# Altium schematic sheet Esp32_Wroom(Contrôle de RFID).SchDoc
size Tabloid; SheetNumber: 6; SheetTotal: 7
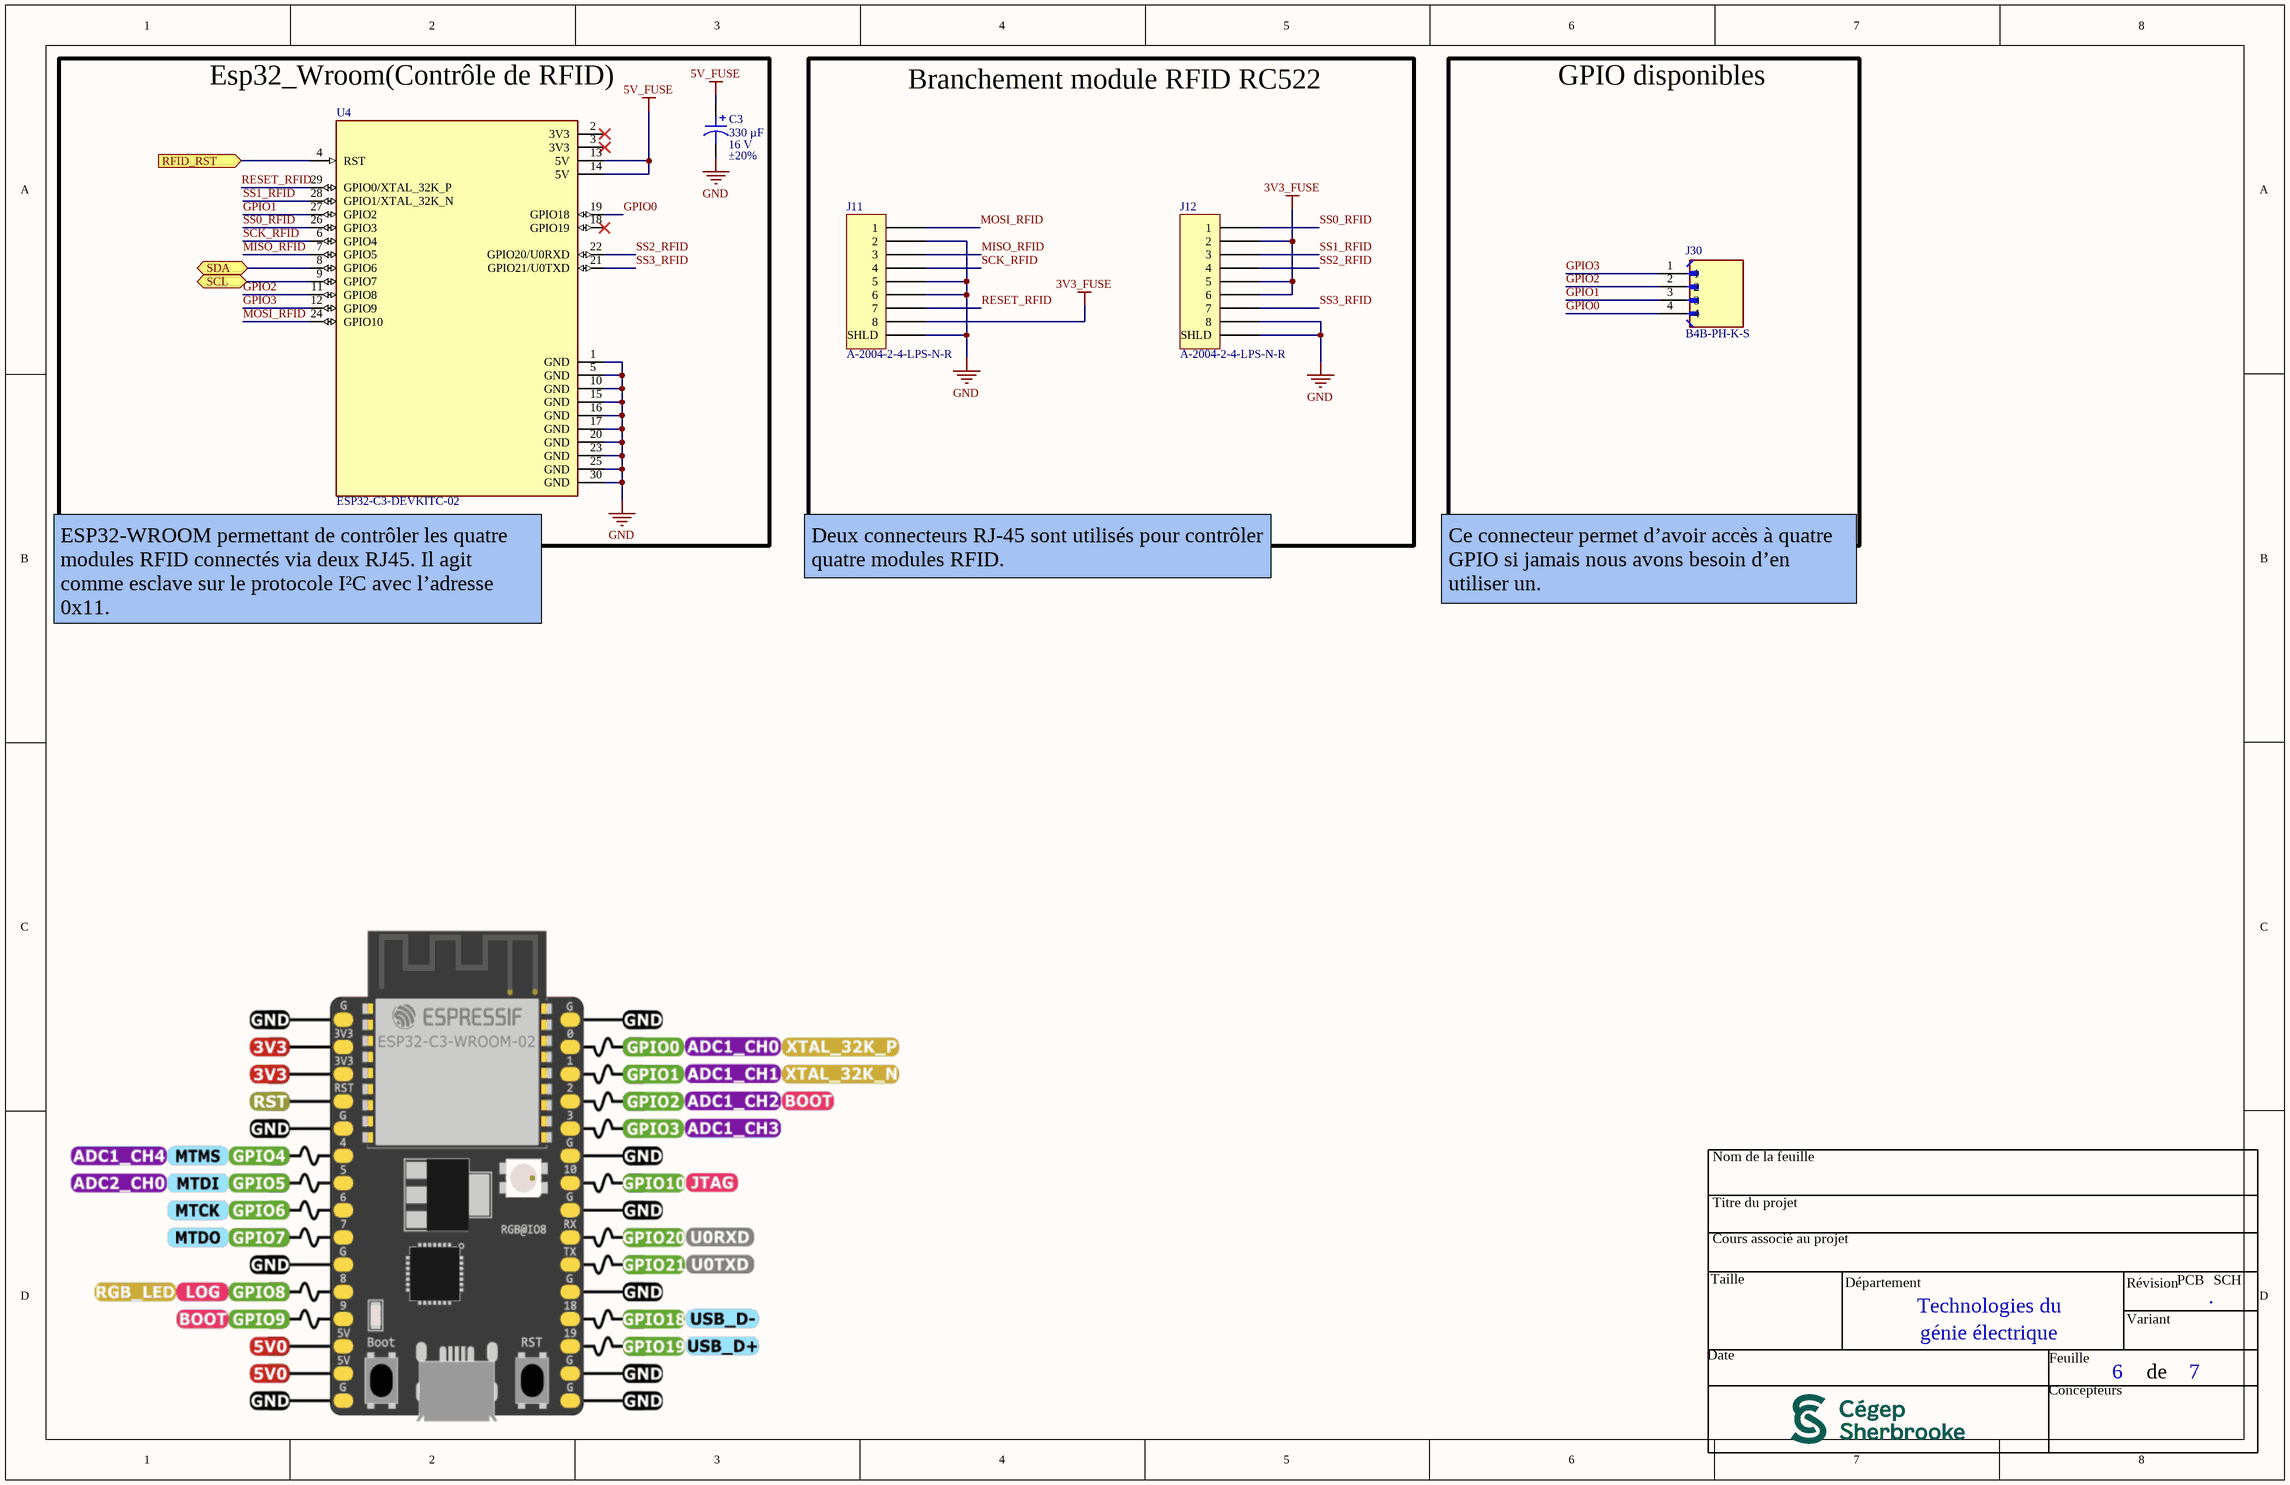
[diagram p0: Esp32_Wroom(Contrôle de RFID).SchDoc]

## Parts
C3  330 µF  Tolerance: ±20%  Voltage - Rated: 16 V  [CAP ALSMD 8.3MM H10.5MM]
J11  A-2004-2-4-LPS-N-R  [ASSMANN A-2004-2-4-LPS-N-R]
J12  A-2004-2-4-LPS-N-R  [ASSMANN A-2004-2-4-LPS-N-R]
J30  B4B-PH-K-S  [JST_B4B-PH-K-S]
U4  ESP32-C3-DEVKITC-02  [XCVR_ESP32-C3-DEVKITC-02]

## Blocks framed on the sheet
Esp32_Wroom(Contrôle de RFID): C3 U4
Branchement module RFID RC522: J11 J12
GPIO disponibles: J30

## Ports
RFID_RST (in), SCL (bidir), SDA (bidir)

## Nets
3V3_FUSE: J11.8 J12.2 J12.5 J12.6
5V_FUSE: C3.1 U4.13(5V) U4.14(5V)
GND: C3.2 J11.2 J11.5 J11.6 J11.S(SHLD) J12.8 J12.S(SHLD) U4.1(GND) U4.5(GND) U4.10(GND) U4.15(GND) U4.16(GND) U4.17(GND) U4.20(GND) U4.23(GND) U4.25(GND) U4.30(GND)
GPIO0: J30.4 U4.19(GPIO18)
GPIO1: J30.3 U4.27(GPIO2)
GPIO2: J30.2 U4.11(GPIO8)
GPIO3: J30.1 U4.12(GPIO9)
MISO_RFID: J11.3 U4.7(GPIO5)
MOSI_RFID: J11.1 U4.24(GPIO10)
RESET_RFID: J11.7 U4.29(GPIO0/XTAL_32K_P)
RFID_RST: U4.4(RST) ; port RFID_RST
SCK_RFID: J11.4 U4.6(GPIO4)
SCL: U4.9(GPIO7) ; port SCL
SDA: U4.8(GPIO6) ; port SDA
SS0_RFID: J12.1 U4.26(GPIO3)
SS1_RFID: J12.3 U4.28(GPIO1/XTAL_32K_N)
SS2_RFID: J12.4 U4.22(GPIO20/U0RXD)
SS3_RFID: J12.7 U4.21(GPIO21/U0TXD)

Not connected (* = marked no-connect by the designer): U4 2(3V3)* 3(3V3)* 18(GPIO19)*

## Notes on the sheet
- (near U4) ESP32-WROOM permettant de contrôler les quatre modules RFID connectés via deux RJ45. Il agit comme esclave sur le protocole I²C avec l’adresse 0x11.
- Deux connecteurs RJ-45 sont utilisés pour contrôler quatre modules RFID.
- Ce connecteur permet d’avoir accès à quatre GPIO si jamais nous avons besoin d’en utiliser un.
- Nom de la feuille
- Titre du projet
- Cours associé au projet
- Taille
- Département
- Technologies du
- Révision
- PCB
- .
- SCH
- Date
- génie électrique
- Feuille
- Variant
- de
- Concepteurs

## Library data of the parts
C3 = 865060353008: CAP ALUM 330UF 20% 16V SMD; manufacturer: Würth Elektronik; Impedance: 170 mOhms; Lifetime @ Temp.: 5000 Hrs @ 105°C; Polarization: Polar; Ripple Current @ High Frequency: 550 mA @ 100 kHz; Ripple Current @ Low Frequency: 357.5 mA @ 120 Hz; Surface Mount Land Size: 0.327" L x 0.327" W (8.30mm x 8.30mm); Part Number: 865060353008; Applications: General Purpose; Capacitance: 330 µF; componentlink1description: Datasheet; componentlink1url: https://katalog.we-online.de/pbs/datasheet/865060353008.pdf; componentlink2description: DigiKey Link; componentlink2url: https://www.digikey.com/en/products/detail/würth-elektronik/865060353008/5728120; Device Package: Radial, Can - SMD; Height - Seated (Max): 0.413" (10.50mm); lastupdated: 2024-06-03 8:15:49 PM; Lifecycle Status: Active; Minimum Order: 1; Mounting Type: Surface Mount; Operating Temperature: -55°C ~ 105°C; Package / Case: Radial, Can - SMD; packaging: TapeAndReel; partid: 7463; Part Status: Active; price: 0.39; series: WCAP-ASLL; Size / Dimension: 0.315" Dia (8.00mm); Supplier 1: DigiKey; Supplier Part Number 1: 732-8525-1-ND; value: 330 µF
J11 J12 = A-2004-2-4-LPS-N-R: CONN MOD JACK 8P8C R/A SHIELDED; Manufacturer: Assmann WSW Components; LED Color: Does Not Contain LED; Number of Ports: 1; Number of Positions/Contacts: 8p8c (RJ45, Ethernet); Tab Direction: Down; Part Number: A-2004-2-4-LPS-N-R; ComponentLink1Description: Datasheet; ComponentLink1URL: http://www.assmann-wsw.com/fileadmin/datasheets/ASS_7323_CO.pdf; ComponentLink2Description: DigiKey Link; ComponentLink2URL: http://digikey.com/product-detail/en/assmann-wsw-components/A-2004-2-4-LPS-N-R/AE10387-ND/2183638; Connector Type: Jack; Contact Finish: Gold; Contact Material: Phosphor Bronze; Features: Board Lock; LastUpdated: 2020-01-15 3:54:20 AM; Lifecycle Status: Active; Minimum Order: 1; Mounting Type: Through Hole; Number of Rows: 1; Orientation: 90° Angle (Right); Packaging: Tray; Part Status: Active; Price: 1.05; Series: -; Shielding: Shielded; Supplier 1: DigiKey; Supplier Part Number 1: AE10387-ND; Termination: Solder
J30 = B4B-PH-K-S: MF: {'manufacturer': u'JST Sales America Inc.'}; Package: None; Price: None; Value: *; MP: B4B-PH-K-S; Availability: Unavailable
U4 = ESP32-C3-DEVKITC-02: The ESP32-C3-DEVKITC-02 Evaluation Board from Espressif Systems is a development platform for wireless applications, offering 802.11 b/g/n Wi-Fi and Bluetooth (BLE) connectivity at 2.4GHz. Powered by the ESP32-C3-WROOM-02 module, it features a 32-bit RISC; SnapEDA_Link: https://www.snapeda.com/parts/ESP32-C3-DevKitC-02/Espressif+Systems/view-part/?ref=snap; Package: None; Value: *; MF: Espressif Systems; MP: ESP32-C3-DevKitC-02; Check_prices: https://www.snapeda.com/parts/ESP32-C3-DevKitC-02/Espressif+Systems/view-part/?ref=eda